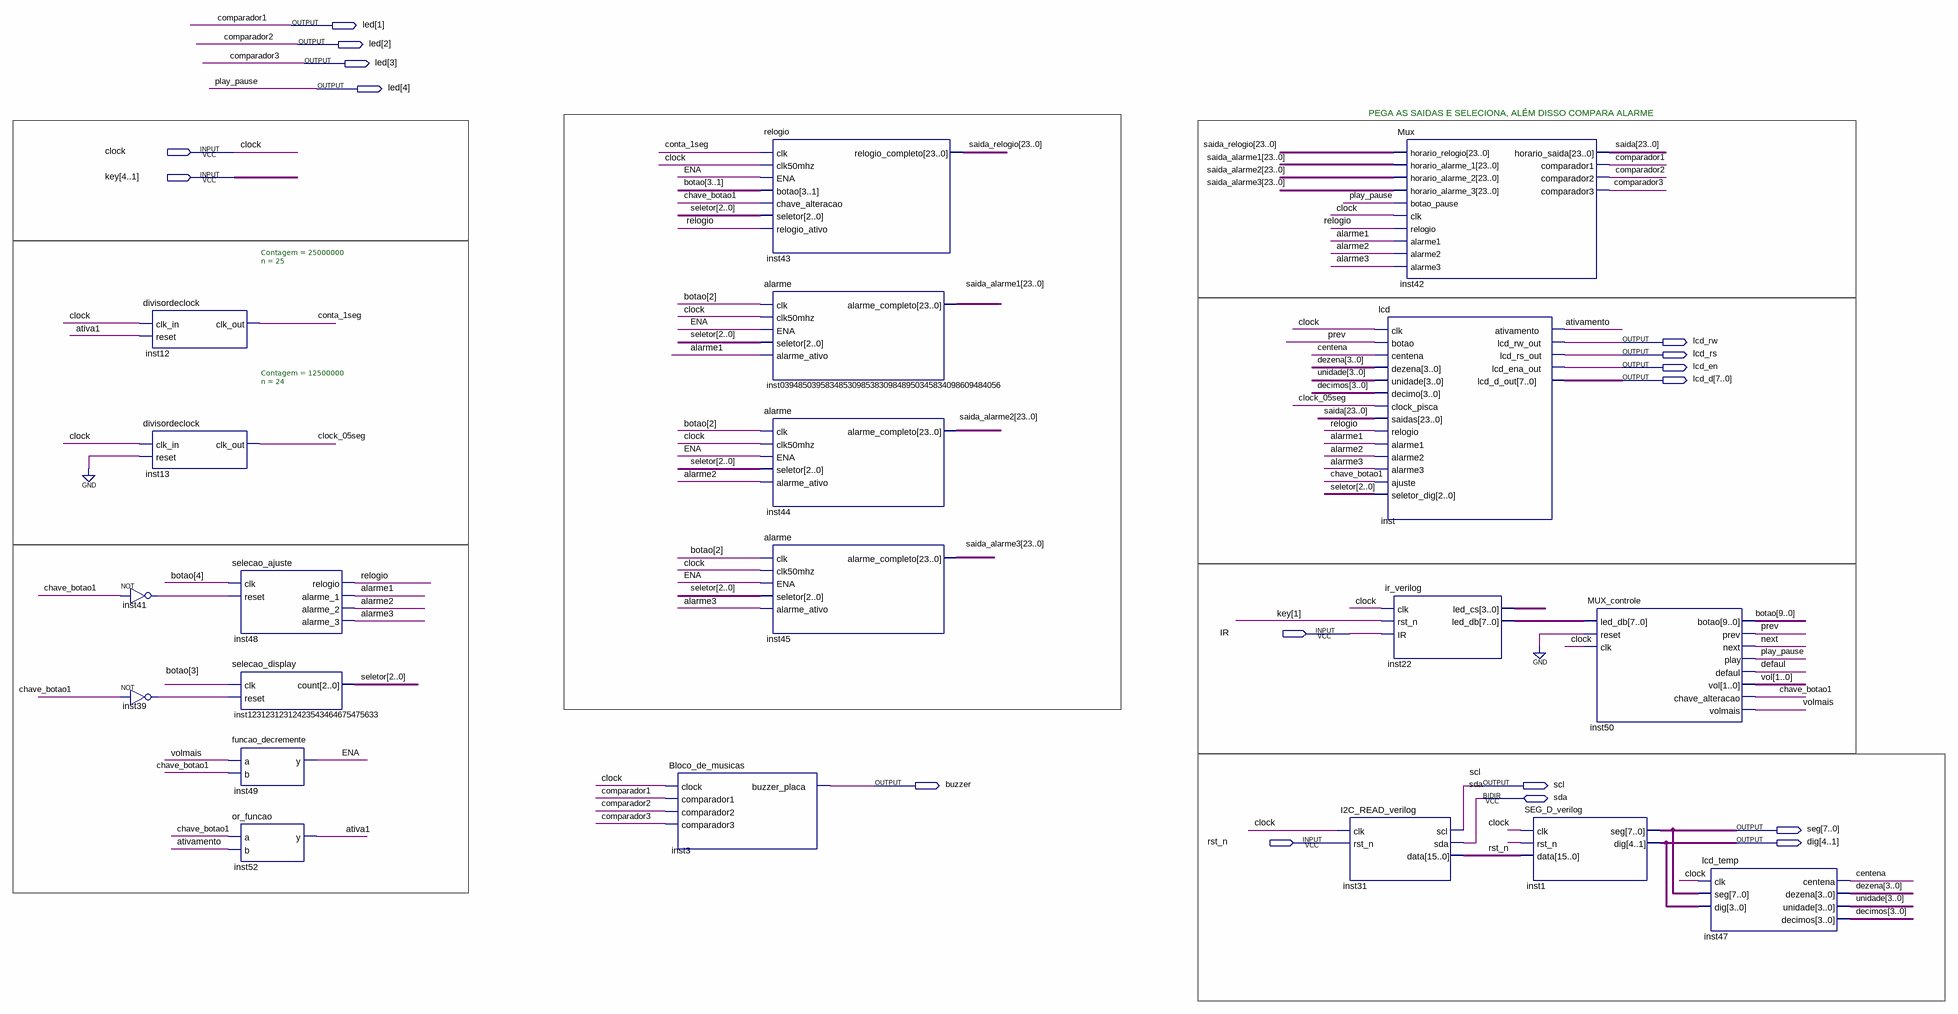
[diagram p0: schematic sheet]
// Quartus schematic projeto4.bdf as structural Verilog: 20 symbols, 17 pins
module projeto4 (
  input  clock,
  input  [4:1] key,
  input  IR,
  input  rst_n,
  inout  sda,
  output [4:1] led,
  output lcd_rw,
  output lcd_rs,
  output lcd_en,
  output [7:0] lcd_d,
  output buzzer,
  output scl,
  output [7:0] seg,
  output [4:1] dig
);

  wire alarme1, alarme2, alarme3, ativa1, ativamento, centena, chave_botao1, clock_05seg, conta_1seg, defaul,
       ENA, inst39_out, inst41_out, next, prev, relogio, volmais;
  wire [1:0] vol;
  wire [2:0] seletor;
  wire [3:0] decimos, dezena, inst22_led_cs, unidade;
  wire [7:0] inst22_led_db;
  wire [9:0] botao;
  wire [15:0] inst31_data;
  wire [23:0] saida, saida_alarme1, saida_alarme2, saida_alarme3, saida_relogio;

  divisordeclock #(.Contagem(25000000), .n(25)) inst12 (.clk_in(clock), .reset(ativa1), .clk_out(conta_1seg));
  divisordeclock #(.Contagem(12500000), .n(24)) inst13 (.clk_in(clock), .reset(1'b0), .clk_out(clock_05seg));
  not inst41 (inst41_out, chave_botao1);
  not inst39 (inst39_out, chave_botao1);
  selecao_ajuste inst48 (
    .clk(botao[4]), .reset(inst41_out), .relogio(relogio), .alarme_1(alarme1), .alarme_2(alarme2),
    .alarme_3(alarme3));
  selecao_display inst12312312312423543464675475633 (.clk(botao[3]), .reset(inst39_out), .count(seletor));
  funcao_decremente inst49 (.a(volmais), .b(chave_botao1), .y(ENA));
  or_funcao inst52 (.a(chave_botao1), .b(ativamento), .y(ativa1));
  Bloco_de_musicas inst3 (
    .clock(clock), .comparador1(led[1]), .comparador2(led[2]), .comparador3(led[3]), .buzzer_placa(buzzer));
  relogio inst43 (
    .clk(conta_1seg), .clk50mhz(clock), .ENA(ENA), .botao(botao[3:1]), .chave_alteracao(chave_botao1),
    .seletor(seletor), .relogio_ativo(relogio), .relogio_completo(saida_relogio));
  alarme inst0394850395834853098538309848950345834098609484056 (
    .clk(botao[2]), .clk50mhz(clock), .ENA(ENA), .seletor(seletor), .alarme_ativo(alarme1),
    .alarme_completo(saida_alarme1));
  alarme inst44 (
    .clk(botao[2]), .clk50mhz(clock), .ENA(ENA), .seletor(seletor), .alarme_ativo(alarme2),
    .alarme_completo(saida_alarme2));
  alarme inst45 (
    .clk(botao[2]), .clk50mhz(clock), .ENA(ENA), .seletor(seletor), .alarme_ativo(alarme3),
    .alarme_completo(saida_alarme3));
  I2C_READ_verilog inst31 (.clk(clock), .rst_n(rst_n), .scl(scl), .data(inst31_data), .sda(sda));
  Mux inst42 (
    .horario_relogio(saida_relogio), .horario_alarme_1(saida_alarme1), .horario_alarme_2(saida_alarme2),
    .horario_alarme_3(saida_alarme3), .botao_pause(led[4]), .clk(clock), .relogio(relogio),
    .alarme1(alarme1), .alarme2(alarme2), .alarme3(alarme3), .horario_saida(saida), .comparador1(led[1]),
    .comparador2(led[2]), .comparador3(led[3]));
  lcd inst (
    .clk(clock), .botao(prev), .centena(centena), .dezena(dezena), .unidade(unidade), .decimo(decimos),
    .clock_pisca(clock_05seg), .saidas(saida), .relogio(relogio), .alarme1(alarme1), .alarme2(alarme2),
    .alarme3(alarme3), .ajuste(chave_botao1), .seletor_dig(seletor), .ativamento(ativamento),
    .lcd_rw_out(lcd_rw), .lcd_rs_out(lcd_rs), .lcd_ena_out(lcd_en), .lcd_d_out(lcd_d));
  ir_verilog inst22 (.clk(clock), .rst_n(key[1]), .IR(IR), .led_cs(inst22_led_cs), .led_db(inst22_led_db));
  SEG_D_verilog inst1 (.clk(clock), .rst_n(rst_n), .data(inst31_data), .seg(seg), .dig(dig));
  MUX_controle inst50 (
    .led_db(inst22_led_db), .reset(1'b0), .clk(clock), .botao(botao), .prev(prev), .next(next),
    .play(led[4]), .defaul(defaul), .vol(vol), .chave_alteracao(chave_botao1), .volmais(volmais));
  lcd_temp inst47 (
    .clk(clock), .seg(seg), .dig(dig), .centena(centena), .dezena(dezena), .unidade(unidade),
    .decimos(decimos));

  // Other names for the same wires on the sheet: comparador1 = led[1]; comparador2 = led[2]; comparador3 = led[3];
  //   play_pause = led[4]

  // Notes on the sheet:
  //   PEGA AS SAIDAS E SELECIONA, ALÉM DISSO COMPARA ALARME
endmodule
